# Altium schematic sheet HTU21D humitemp sensor.SchDoc
size A4; SheetNumber: 5; SheetTotal: 12
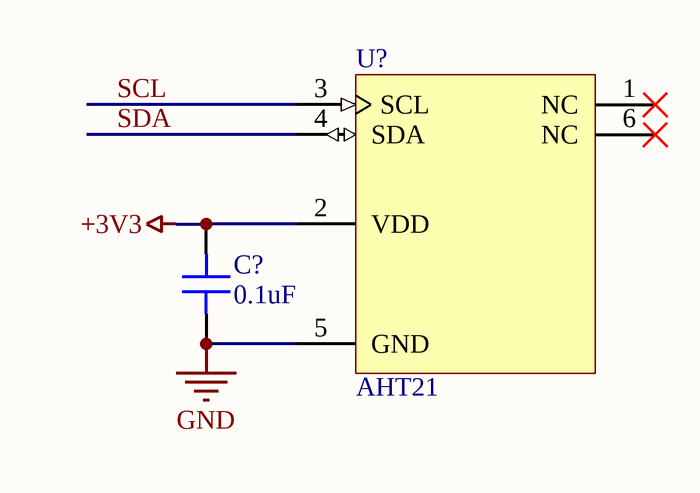
[diagram p0: HTU21D humitemp sensor.SchDoc]

## Parts
C?  0.1uF  [CAPC1005X06N]
U?  AHT21  [SMD_L3.0-W3.0-P1.00(AHT21)]

## Nets
+3V3: C?.2 U?.2(VDD)
GND: C?.1 U?.5(GND)
SCL: U?.3(SCL)
SDA: U?.4(SDA)

Not connected (* = marked no-connect by the designer): U? 1(NC)* 6(NC)*

## Library data of the parts
C? = 0402B104K500CT: Manufacturer: Walsin Tech Corp; Voltage: 50V; Tolerance: 10%; Dielectric: X7R; Min Temperature: -55; Max Temperature: 125; ComponentLink1URL: https://datasheet.lcsc.com/lcsc/1810191621_Walsin-Tech-Corp-0402B104K500CT_C152814.pdf; ComponentLink1Description: Datasheet; Package: 0402; Part Status: Active; Capacitance: 0.1uF; Part Number: 0402B104K500CT
U? = AHT21: MANUFACTURER: Aosong (Guangzhou) Elec; COMPONENTLINK1URL: https://datasheet.lcsc.com/lcsc/2104190935_Aosong--Guangzhou-Elec-AHT21_C2827328.pdf; COMPONENTLINK1DESCRIPTION: Datasheet; PACKAGE: SMD-3x3x1; Part Status: Active; Part Number: AHT21